# EAGLE design fmcboard_v1.2 (EAGLE 9.6.2)

## Sheet 1 of 4: Power, IO, Arduino
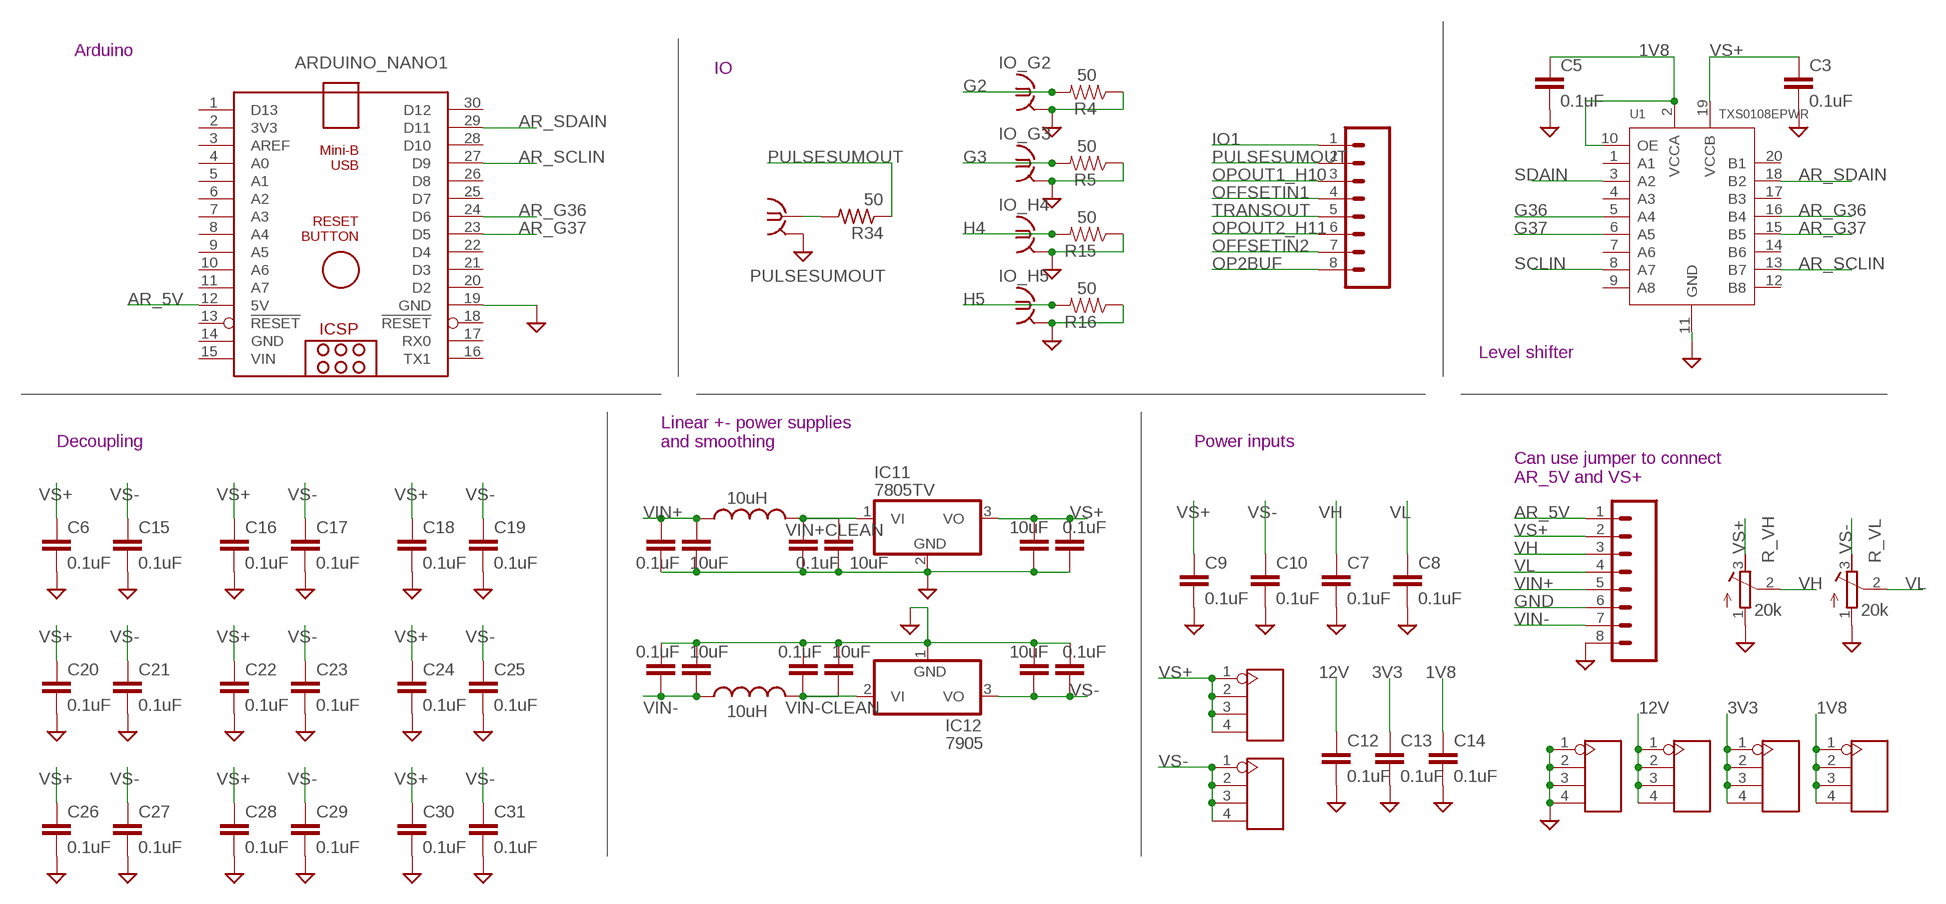
[diagram p0: schematic, sheet 1]

### Parts
ARDUINO_NANO1  1  ARDUINO_NANO  [ARDUINO_NANO]
C1  10uF  CAPPTH1  [CAP-PTH-5MM]
C2  10uF  CAPPTH1  [CAP-PTH-5MM]
C3  0.1uF  CAP0805  [0805]
C5  0.1uF  CAP0805  [0805]
C6  0.1uF  CAP0805  [0805]
C7  0.1uF  CAP0805  [0805]
C8  0.1uF  CAP0805  [0805]
C9  0.1uF  CAP0805  [0805]
C10  0.1uF  CAP0805  [0805]
C12  0.1uF  CAP0805  [0805]
C13  0.1uF  CAP0805  [0805]
C14  0.1uF  CAP0805  [0805]
C15  0.1uF  CAP0805  [0805]
C16  0.1uF  CAP0805  [0805]
C17  0.1uF  CAP0805  [0805]
C18  0.1uF  CAP0805  [0805]
C19  0.1uF  CAP0805  [0805]
C20  0.1uF  CAP0805  [0805]
C21  0.1uF  CAP0805  [0805]
C22  0.1uF  CAP0805  [0805]
C23  0.1uF  CAP0805  [0805]
C24  0.1uF  CAP0805  [0805]
C25  0.1uF  CAP0805  [0805]
C26  0.1uF  CAP0805  [0805]
C27  0.1uF  CAP0805  [0805]
C28  0.1uF  CAP0805  [0805]
C29  0.1uF  CAP0805  [0805]
C30  0.1uF  CAP0805  [0805]
C31  0.1uF  CAP0805  [0805]
C38  10uF  CAPPTH1  [CAP-PTH-5MM]
C39  10uF  CAPPTH1  [CAP-PTH-5MM]
C40  10uF  CAPPTH1  [CAP-PTH-5MM]
C41  10uF  CAPPTH1  [CAP-PTH-5MM]
C42  0.1uF  CAP0805  [0805]
C43  0.1uF  CAP0805  [0805]
C44  0.1uF  CAP0805  [0805]
C45  0.1uF  CAP0805  [0805]
C46  0.1uF  CAP0805  [0805]
C47  0.1uF  CAP0805  [0805]
IC11  7805TV  [TO220V]
IC12  7905  7905T  [TO220H]
IO_G2  BU-SMB-V  [BU-SMB-V]
IO_G3  BU-SMB-V  [BU-SMB-V]
IO_H4  BU-SMB-V  [BU-SMB-V]
IO_H5  BU-SMB-V  [BU-SMB-V]
J1  8pin  CONN_08"  [1X08]
J3  4p-2.54  DIP-BLACK-FEMALE-HEADER-VERT(4P-2.54)  [H4-2.54]
J4  4p-2.54  DIP-BLACK-FEMALE-HEADER-VERT(4P-2.54)  [H4-2.54]
J5  8pin  CONN_08"  [1X08]
J6  4p-2.54  DIP-BLACK-FEMALE-HEADER-VERT(4P-2.54)  [H4-2.54]
J7  4p-2.54  DIP-BLACK-FEMALE-HEADER-VERT(4P-2.54)  [H4-2.54]
J8  4p-2.54  DIP-BLACK-FEMALE-HEADER-VERT(4P-2.54)  [H4-2.54]
J12  4p-2.54  DIP-BLACK-FEMALE-HEADER-VERT(4P-2.54)  [H4-2.54]
L1  10uH  L-US6000-XXX-RC  [6000-XXXX-RC]
L2  10uH  L-US6000-XXX-RC  [6000-XXXX-RC]
PULSESUMOUT  BU-SMB-V  [BU-SMB-V]
R4  50  RESISTORAXIAL-0.3  [AXIAL-0.3]
R5  50  RESISTORAXIAL-0.3  [AXIAL-0.3]
R15  50  RESISTORAXIAL-0.3  [AXIAL-0.3]
R16  50  RESISTORAXIAL-0.3  [AXIAL-0.3]
R34  50  R-US_R0805  [R0805]
R_VH  20k  R-TRIMM3296W  [RTRIM3296W]
R_VL  20k  R-TRIMM3296W  [RTRIM3296W]
U1  TXS0108EPWR  LOGIC-TXS0108EPWR(TSSOP20)  [TSSOP20-0.65-6.5X4.4MM]

### Nets
1V8 [power]: C5.1 C14.1 J12.1 J12.2 J12.3 J12.4 U1.2(VCCA) U1.10(OE) ; also sheet 4
3V3 [power]: C13.1 J3.1 J3.2 J3.3 J3.4 ; also sheet 4
12V [power]: C12.1 J8.1 J8.2 J8.3 J8.4 ; also sheet 4
AR_5V [power]: ARDUINO_NANO1.12(5V) J1.1
AR_G36: ARDUINO_NANO1.24(D6) U1.16(B4)
AR_G37: ARDUINO_NANO1.23(D5) U1.15(B5)
AR_SCLIN: ARDUINO_NANO1.27(D9) U1.13(B7)
AR_SDAIN: ARDUINO_NANO1.29(D11) U1.18(B2)
G2: IO_G2.1 R4.P$2 ; also sheet 4
G3: IO_G3.1 R5.P$2 ; also sheet 4
G36: U1.5(A4) ; also sheet 4
G37: U1.6(A5) ; also sheet 4
GND [gnd]: ARDUINO_NANO1.19(GND) C1.2 C2.1 C3.2 C5.2 C6.2 C7.2 C8.2 C9.2 C10.2 C12.2 C13.2 C14.2 C15.2 C16.2 C17.2 C18.2 C19.2 C20.2 C21.2 C22.2 C23.2 C24.2 C25.2 C26.2 C27.2 C28.2 C29.2 C30.2 C31.2 C38.2 C39.2 C40.2 C41.2 C42.2 C43.2 C44.1 C45.1 C46.1 C47.2 IC11.2(GND) IC12.1(GND) IO_G2.2 IO_G2.3 IO_G2.4 IO_G2.5 IO_G3.2 IO_G3.3 IO_G3.4 IO_G3.5 IO_H4.2 IO_H4.3 IO_H4.4 IO_H4.5 IO_H5.2 IO_H5.3 IO_H5.4 IO_H5.5 J1.6 J1.8 J4.1 J4.2 J4.3 J4.4 PULSESUMOUT.2 PULSESUMOUT.3 PULSESUMOUT.4 PULSESUMOUT.5 R4.P$1 R5.P$1 R15.P$1 R16.P$1 R_VH.1(A) R_VL.1(A) U1.11(GND) ; also sheet 2,3,4
H4: IO_H4.1 R15.P$2 ; also sheet 4
H5: IO_H5.1 R16.P$2 ; also sheet 4
IO1: J5.1 ; also sheet 3
N$18: PULSESUMOUT.1 R34.2
OFFSETIN1: J5.4 ; also sheet 3
OFFSETIN2: J5.7 ; also sheet 3
OP2BUF: J5.8 ; also sheet 3
OPOUT1_H10: J5.3 ; also sheet 3,4
OPOUT2_H11: J5.6 ; also sheet 3,4
PULSESUMOUT: J5.2 R34.1 ; also sheet 3
SCLIN: U1.8(A7) ; also sheet 4
SDAIN: U1.3(A2) ; also sheet 4
TRANSOUT: J5.5 ; also sheet 3
VH: C7.1 J1.3 R_VH.2(S) ; also sheet 3
VIN+ [power]: C39.1 C42.1 J1.5 L1.1
VIN+CLEAN [power]: C38.1 C43.1 IC11.1(VI) L1.2
VIN- [power]: C40.1 C44.2 J1.7 L2.1
VIN-CLEAN [power]: C41.1 C45.2 IC12.2(VI) L2.2
VL: C8.1 J1.4 R_VL.2(S) ; also sheet 3
VS+ [power]: C1.1 C3.1 C6.1 C9.1 C16.1 C18.1 C20.1 C22.1 C24.1 C26.1 C28.1 C30.1 C47.1 IC11.3(VO) J1.2 J6.1 J6.2 J6.3 J6.4 R_VH.3(E) U1.19(VCCB) ; also sheet 2,3
VS- [power]: C2.2 C10.1 C15.1 C17.1 C19.1 C21.1 C23.1 C25.1 C27.1 C29.1 C31.1 C46.2 IC12.3(VO) J7.1 J7.2 J7.3 J7.4 R_VL.3(E) ; also sheet 2,3
Unconnected: ARDUINO_NANO1.1(D13) ARDUINO_NANO1.2(3V3) ARDUINO_NANO1.3(AREF) ARDUINO_NANO1.4(A0) ARDUINO_NANO1.5(A1) ARDUINO_NANO1.6(A2) ARDUINO_NANO1.7(A3) ARDUINO_NANO1.8(A4) ARDUINO_NANO1.9(A5) ARDUINO_NANO1.10(A6) ARDUINO_NANO1.11(A7) ARDUINO_NANO1.13(!RESET) ARDUINO_NANO1.16(TX1) ARDUINO_NANO1.17(RX0) ARDUINO_NANO1.18(!RESET) ARDUINO_NANO1.20(D2) ARDUINO_NANO1.21(D3) ARDUINO_NANO1.22(D4) ARDUINO_NANO1.25(D7) ARDUINO_NANO1.26(D8) ARDUINO_NANO1.28(D10) ARDUINO_NANO1.30(D12) U1.1(A1) U1.4(A3) U1.7(A6) U1.9(A8) U1.12(B8) U1.14(B6) U1.17(B3) U1.20(B1)

### Notes on the sheet
- Arduino
- IO
- Level shifter
- Decoupling
- Linear +- power supplies
  and smoothing
- Power inputs
- Can use jumper to connect 
  AR_5V and VS+

## Sheet 2 of 4: Pulse generator
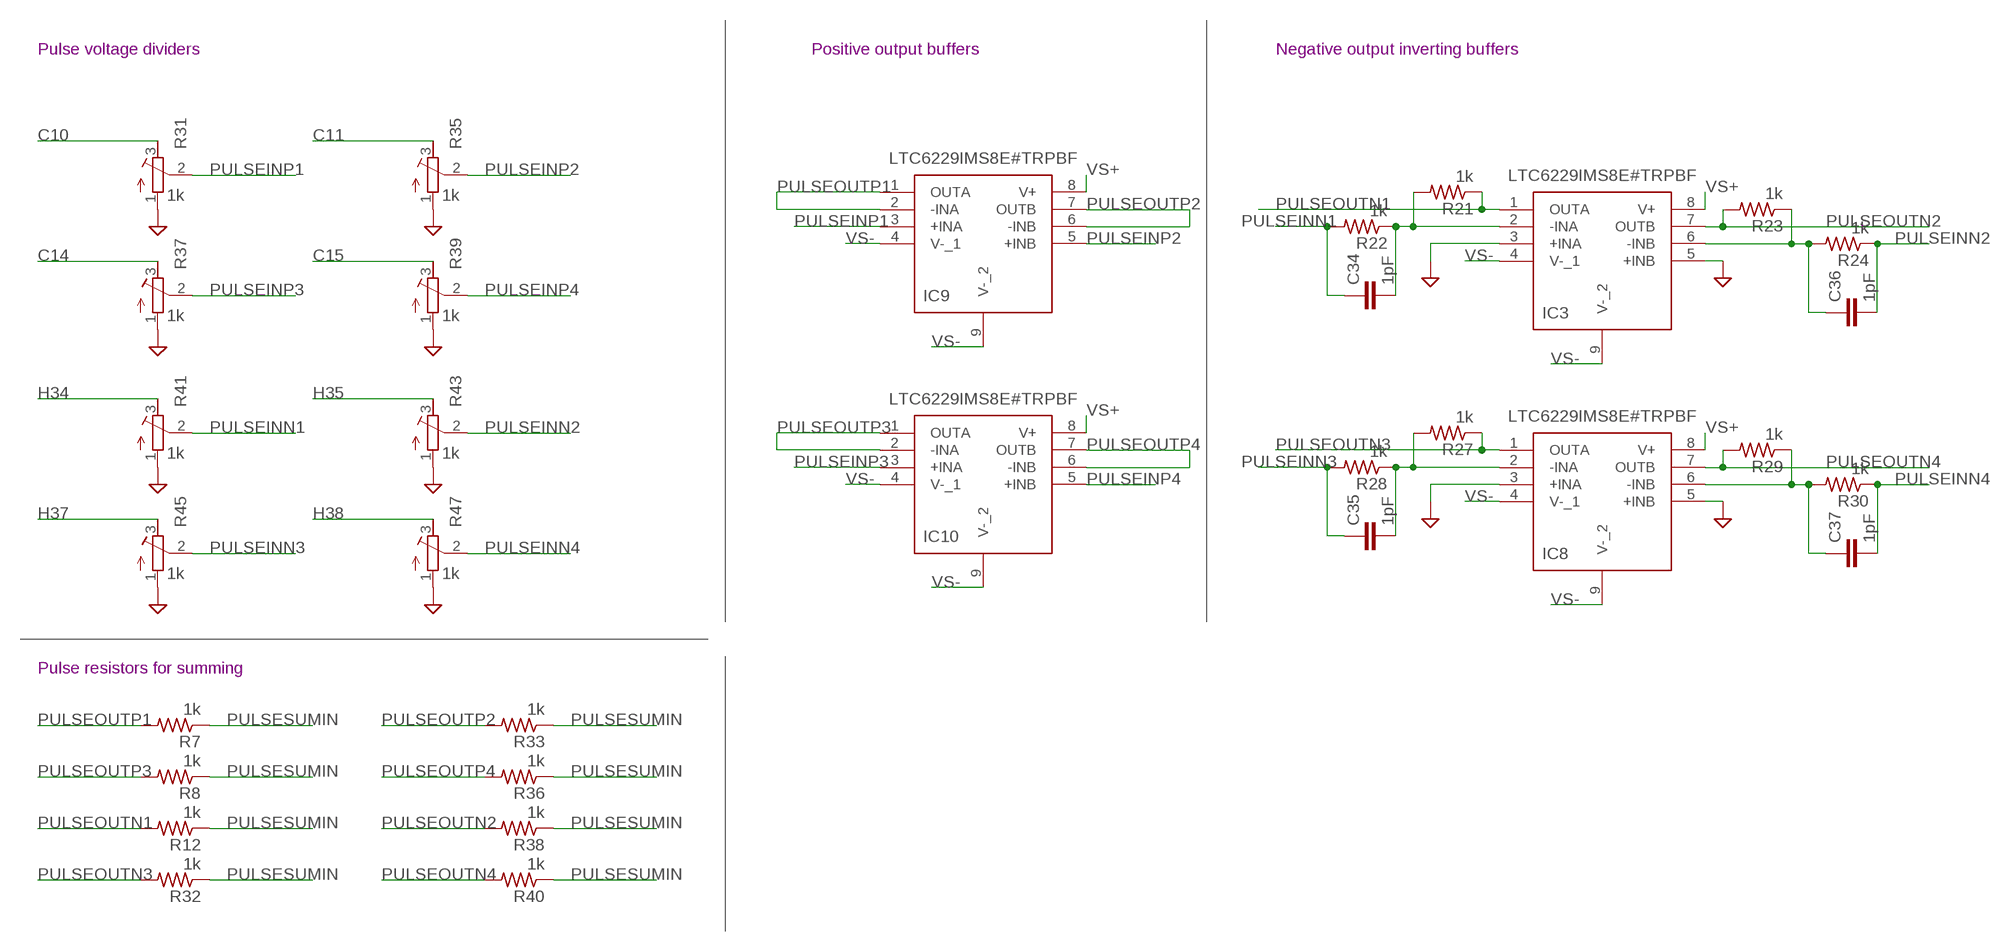
[diagram p1: schematic, sheet 2]

### Parts
C34  1pF  CAP0805  [0805]
C35  1pF  CAP0805  [0805]
C36  1pF  CAP0805  [0805]
C37  1pF  CAP0805  [0805]
IC3  LTC6229IMS8E#TRPBF  [SOP65P490X110-9N]
IC8  LTC6229IMS8E#TRPBF  [SOP65P490X110-9N]
IC9  LTC6229IMS8E#TRPBF  [SOP65P490X110-9N]
IC10  LTC6229IMS8E#TRPBF  [SOP65P490X110-9N]
R7  1k  R-US_R0805  [R0805]
R8  1k  R-US_R0805  [R0805]
R12  1k  R-US_R0805  [R0805]
R21  1k  R-US_R0805  [R0805]
R22  1k  R-US_R0805  [R0805]
R23  1k  R-US_R0805  [R0805]
R24  1k  R-US_R0805  [R0805]
R27  1k  R-US_R0805  [R0805]
R28  1k  R-US_R0805  [R0805]
R29  1k  R-US_R0805  [R0805]
R30  1k  R-US_R0805  [R0805]
R31  1k  R-TRIMM3296W  [RTRIM3296W]
R32  1k  R-US_R0805  [R0805]
R33  1k  R-US_R0805  [R0805]
R35  1k  R-TRIMM3296W  [RTRIM3296W]
R36  1k  R-US_R0805  [R0805]
R37  1k  R-TRIMM3296W  [RTRIM3296W]
R38  1k  R-US_R0805  [R0805]
R39  1k  R-TRIMM3296W  [RTRIM3296W]
R40  1k  R-US_R0805  [R0805]
R41  1k  R-TRIMM3296W  [RTRIM3296W]
R43  1k  R-TRIMM3296W  [RTRIM3296W]
R45  1k  R-TRIMM3296W  [RTRIM3296W]
R47  1k  R-TRIMM3296W  [RTRIM3296W]

### Nets
C10: R31.3(E) ; also sheet 4
C11: R35.3(E) ; also sheet 4
C14: R37.3(E) ; also sheet 4
C15: R39.3(E) ; also sheet 4
GND [gnd]: IC3.3(+INA) IC3.5(+INB) IC8.3(+INA) IC8.5(+INB) R31.1(A) R35.1(A) R37.1(A) R39.1(A) R41.1(A) R43.1(A) R45.1(A) R47.1(A) ; also sheet 1,3,4
H34: R41.3(E) ; also sheet 4
H35: R43.3(E) ; also sheet 4
H37: R45.3(E) ; also sheet 4
H38: R47.3(E) ; also sheet 4
N$4: C36.1 IC3.6(-INB) R23.1 R24.2
N$12: C35.2 IC8.2(-INA) R27.2 R28.1
N$13: C34.2 IC3.2(-INA) R21.2 R22.1
N$14: C37.1 IC8.6(-INB) R29.1 R30.2
PULSEINN1: C34.1 R22.2 R41.2(S)
PULSEINN2: C36.2 R24.1 R43.2(S)
PULSEINN3: C35.1 R28.2 R45.2(S)
PULSEINN4: C37.2 R30.1 R47.2(S)
PULSEINP1: IC9.3(+INA) R31.2(S)
PULSEINP2: IC9.5(+INB) R35.2(S)
PULSEINP3: IC10.3(+INA) R37.2(S)
PULSEINP4: IC10.5(+INB) R39.2(S)
PULSEOUTN1: IC3.1(OUTA) R12.2 R21.1
PULSEOUTN2: IC3.7(OUTB) R23.2 R38.2
PULSEOUTN3: IC8.1(OUTA) R27.1 R32.2
PULSEOUTN4: IC8.7(OUTB) R29.2 R40.2
PULSEOUTP1: IC9.1(OUTA) IC9.2(-INA) R7.2
PULSEOUTP2: IC9.6(-INB) IC9.7(OUTB) R33.2
PULSEOUTP3: IC10.1(OUTA) IC10.2(-INA) R8.2
PULSEOUTP4: IC10.6(-INB) IC10.7(OUTB) R36.2
PULSESUMIN: R7.1 R8.1 R12.1 R32.1 R33.1 R36.1 R38.1 R40.1 ; also sheet 3
VS+ [power]: IC3.8(V+) IC8.8(V+) IC9.8(V+) IC10.8(V+) ; also sheet 1,3
VS- [power]: IC3.4(V-_1) IC3.9(V-_2) IC8.4(V-_1) IC8.9(V-_2) IC9.4(V-_1) IC9.9(V-_2) IC10.4(V-_1) IC10.9(V-_2) ; also sheet 1,3

### Notes on the sheet
- Pulse voltage dividers | Positive output buffers | Negative output inverting buffers
- Pulse resistors for summing

## Sheet 3 of 4: Input amplifiers
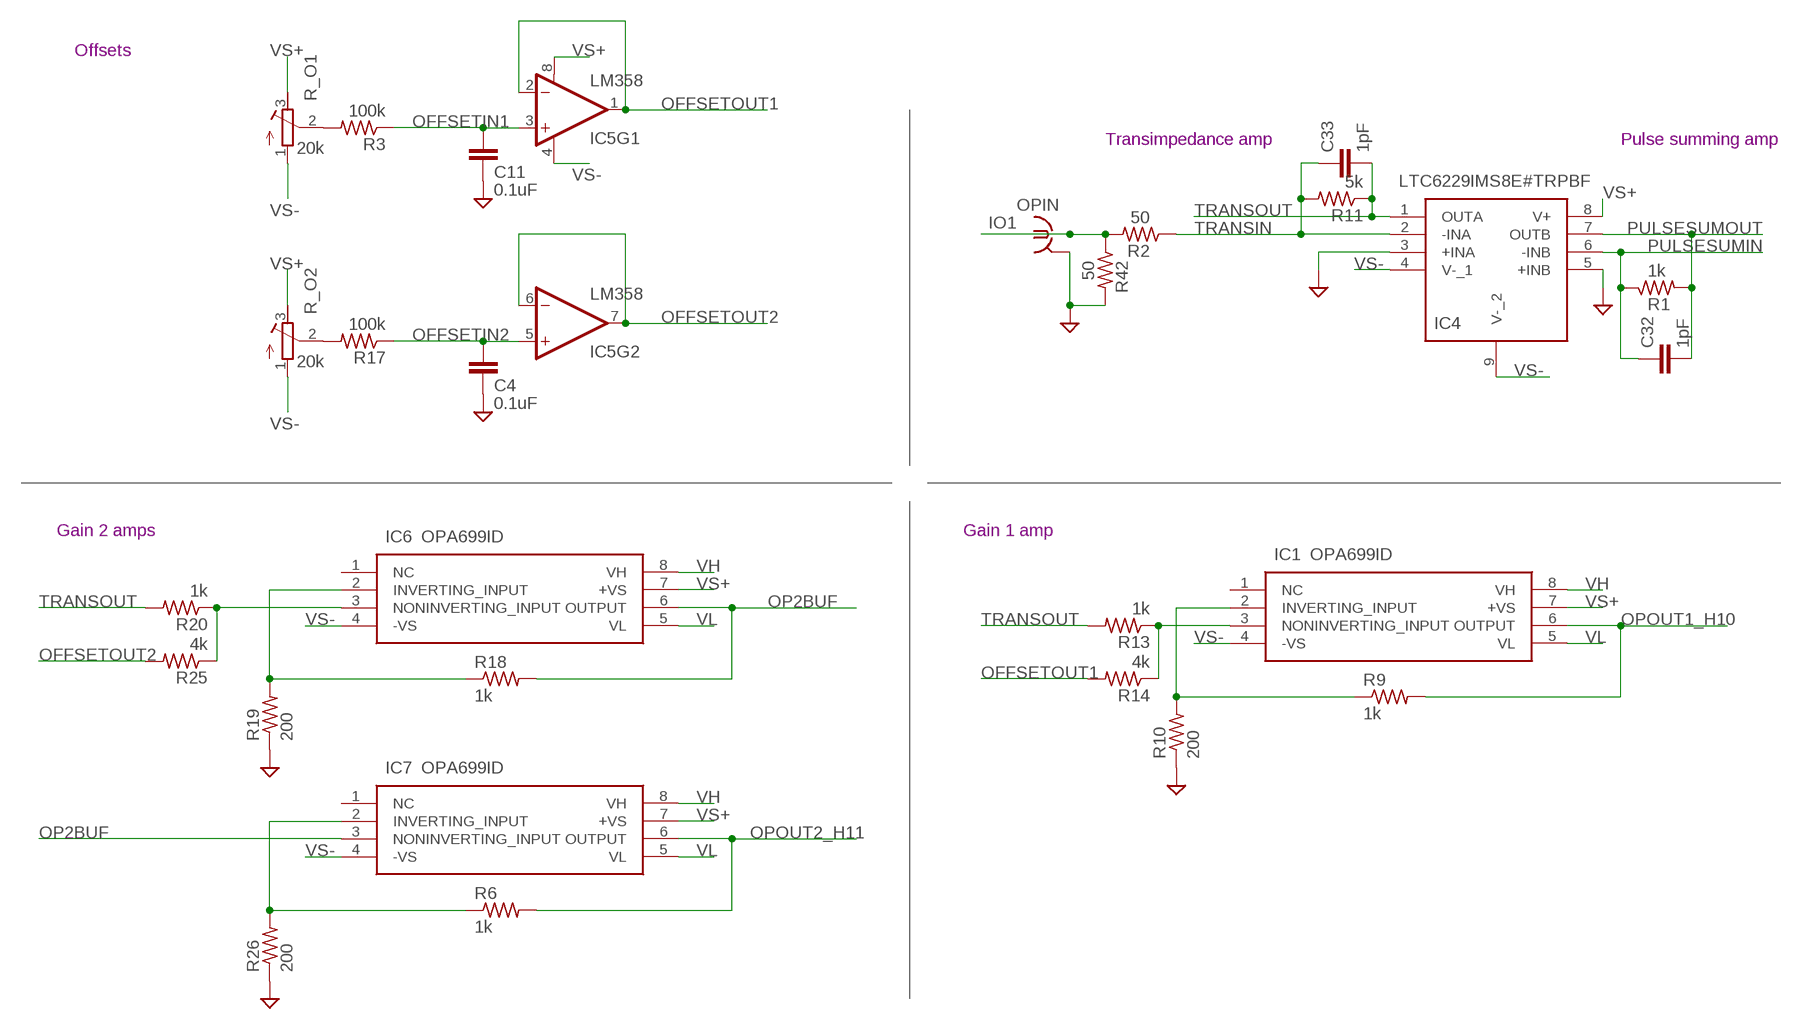
[diagram p2: schematic, sheet 3]

### Parts
C4  0.1uF  CAP0805  [0805]
C11  0.1uF  CAP0805  [0805]
C32  1pF  CAP0805  [0805]
C33  1pF  CAP0805  [0805]
IC1  OPA699ID  [SOIC127P600X175-8N]
IC4  LTC6229IMS8E#TRPBF  [SOP65P490X110-9N]
IC5  LM358  [DIP08]
IC6  OPA699ID  [SOIC127P600X175-8N]
IC7  OPA699ID  [SOIC127P600X175-8N]
OPIN  BU-SMB-V  [BU-SMB-V]
R1  1k  R-US_R0805  [R0805]
R2  50  R-US_R0805  [R0805]
R3  100k  R-US_R0805  [R0805]
R6  1k  R-US_R0805  [R0805]
R9  1k  R-US_R0805  [R0805]
R10  200  R-US_R0805  [R0805]
R11  5k  R-US_R0805  [R0805]
R13  1k  R-US_R0805  [R0805]
R14  4k  R-US_R0805  [R0805]
R17  100k  R-US_R0805  [R0805]
R18  1k  R-US_R0805  [R0805]
R19  200  R-US_R0805  [R0805]
R20  1k  R-US_R0805  [R0805]
R25  4k  R-US_R0805  [R0805]
R26  200  R-US_R0805  [R0805]
R42  50  R-US_R0805  [R0805]
R_O1  20k  R-TRIMM3296W  [RTRIM3296W]
R_O2  20k  R-TRIMM3296W  [RTRIM3296W]

### Nets
GND [gnd]: C4.2 C11.2 IC4.3(+INA) IC4.5(+INB) OPIN.2 OPIN.3 OPIN.4 OPIN.5 R10.1 R19.1 R26.1 R42.2 ; also sheet 1,2,4
IO1: OPIN.1 R2.2 R42.1 ; also sheet 1
N$1: IC1.3(NONINVERTING_INPUT) R13.1 R14.1
N$2: R17.2 R_O2.2(S)
N$3: IC1.2(INVERTING_INPUT) R9.1 R10.2
N$8: R3.2 R_O1.2(S)
N$9: IC6.2(INVERTING_INPUT) R18.1 R19.2
N$10: IC6.3(NONINVERTING_INPUT) R20.1 R25.1
N$11: IC7.2(INVERTING_INPUT) R6.1 R26.2
OFFSETIN1: C11.1 IC5.3(+IN) R3.1 ; also sheet 1
OFFSETIN2: C4.1 IC5.5(+IN) R17.1 ; also sheet 1
OFFSETOUT1: IC5.1(OUT) IC5.2(-IN) R14.2
OFFSETOUT2: IC5.6(-IN) IC5.7(OUT) R25.2
OP2BUF: IC6.6(OUTPUT) IC7.3(NONINVERTING_INPUT) R18.2 ; also sheet 1
OPOUT1_H10: IC1.6(OUTPUT) R9.2 ; also sheet 1,4
OPOUT2_H11: IC7.6(OUTPUT) R6.2 ; also sheet 1,4
PULSESUMIN: C32.1 IC4.6(-INB) R1.1 ; also sheet 2
PULSESUMOUT: C32.2 IC4.7(OUTB) R1.2 ; also sheet 1
TRANSIN: C33.1 IC4.2(-INA) R2.1 R11.2
TRANSOUT: C33.2 IC4.1(OUTA) R11.1 R13.2 R20.2 ; also sheet 1
VH: IC1.8(VH) IC6.8(VH) IC7.8(VH) ; also sheet 1
VL: IC1.5(VL) IC6.5(VL) IC7.5(VL) ; also sheet 1
VS+ [power]: IC1.7(+VS) IC4.8(V+) IC5.8(V+) IC6.7(+VS) IC7.7(+VS) R_O1.3(E) R_O2.3(E) ; also sheet 1,2
VS- [power]: IC1.4(-VS) IC4.4(V-_1) IC4.9(V-_2) IC5.4(V-) IC6.4(-VS) IC7.4(-VS) R_O1.1(A) R_O2.1(A) ; also sheet 1,2
Unconnected: IC1.1(NC) IC6.1(NC) IC7.1(NC)

### Notes on the sheet
- Offsets
- Transimpedance amp | Pulse summing amp
- Gain 2 amps | Gain 1 amp

## Sheet 4 of 4: FMC connections
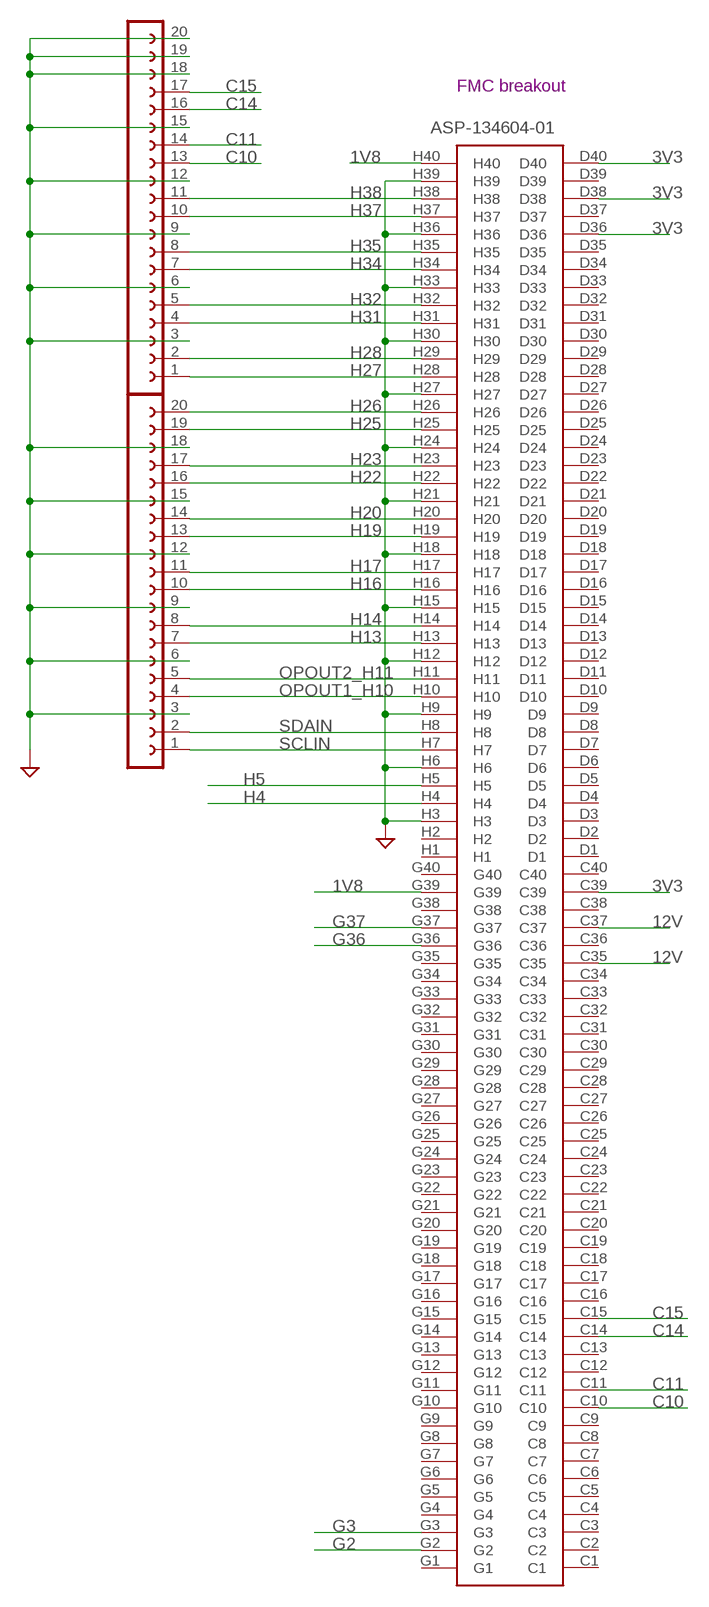
[diagram p3: schematic, sheet 4]

### Parts
J2  ASP-134604-01  [ASP13460401]
SV1  20  FE20-1  [FE20]
SV2  20  FE20-1  [FE20]

### Nets
1V8 [power]: J2.G39 J2.H40 ; also sheet 1
3V3 [power]: J2.C39 J2.D36 J2.D38 J2.D40 ; also sheet 1
12V [power]: J2.C35 J2.C37 ; also sheet 1
C10: J2.C10 SV2.13 ; also sheet 2
C11: J2.C11 SV2.14 ; also sheet 2
C14: J2.C14 SV2.16 ; also sheet 2
C15: J2.C15 SV2.17 ; also sheet 2
G2: J2.G2 ; also sheet 1
G3: J2.G3 ; also sheet 1
G36: J2.G36 ; also sheet 1
G37: J2.G37 ; also sheet 1
GND [gnd]: J2.H3 J2.H6 J2.H9 J2.H12 J2.H15 J2.H18 J2.H21 J2.H24 J2.H27 J2.H30 J2.H33 J2.H36 J2.H39 SV1.3 SV1.6 SV1.9 SV1.12 SV1.15 SV1.18 SV2.3 SV2.6 SV2.9 SV2.12 SV2.15 SV2.18 SV2.19 SV2.20 ; also sheet 1,2,3
H4: J2.H4 ; also sheet 1
H5: J2.H5 ; also sheet 1
H13: J2.H13 SV1.7
H14: J2.H14 SV1.8
H16: J2.H16 SV1.10
H17: J2.H17 SV1.11
H19: J2.H19 SV1.13
H20: J2.H20 SV1.14
H22: J2.H22 SV1.16
H23: J2.H23 SV1.17
H25: J2.H25 SV1.19
H26: J2.H26 SV1.20
H27: J2.H28 SV2.1
H28: J2.H29 SV2.2
H31: J2.H31 SV2.4
H32: J2.H32 SV2.5
H34: J2.H34 SV2.7 ; also sheet 2
H35: J2.H35 SV2.8 ; also sheet 2
H37: J2.H37 SV2.10 ; also sheet 2
H38: J2.H38 SV2.11 ; also sheet 2
OPOUT1_H10: J2.H10 SV1.4 ; also sheet 1,3
OPOUT2_H11: J2.H11 SV1.5 ; also sheet 1,3
SCLIN: J2.H7 SV1.1 ; also sheet 1
SDAIN: J2.H8 SV1.2 ; also sheet 1
Unconnected: J2.C1 J2.C2 J2.C3 J2.C4 J2.C5 J2.C6 J2.C7 J2.C8 J2.C9 J2.C12 J2.C13 J2.C16 J2.C17 J2.C18 J2.C19 J2.C20 J2.C21 J2.C22 J2.C23 J2.C24 J2.C25 J2.C26 J2.C27 J2.C28 J2.C29 J2.C30 J2.C31 J2.C32 J2.C33 J2.C34 J2.C36 J2.C38 J2.C40 J2.D1 J2.D2 J2.D3 J2.D4 J2.D5 J2.D6 J2.D7 J2.D8 J2.D9 J2.D10 J2.D11 J2.D12 J2.D13 J2.D14 J2.D15 J2.D16 J2.D17 J2.D18 J2.D19 J2.D20 J2.D21 J2.D22 J2.D23 J2.D24 J2.D25 J2.D26 J2.D27 J2.D28 J2.D29 J2.D30 J2.D31 J2.D32 J2.D33 J2.D34 J2.D35 J2.D37 J2.D39 J2.G1 J2.G4 J2.G5 J2.G6 J2.G7 J2.G8 J2.G9 J2.G10 J2.G11 J2.G12 J2.G13 J2.G14 J2.G15 J2.G16 J2.G17 J2.G18 J2.G19 J2.G20 J2.G21 J2.G22 J2.G23 J2.G24 J2.G25 J2.G26 J2.G27 J2.G28 J2.G29 J2.G30 J2.G31 J2.G32 J2.G33 J2.G34 J2.G35 J2.G38 J2.G40 J2.H1 J2.H2

### Notes on the sheet
- FMC breakout

## Power pins joined to a net without a drawn wire
GND: ARDUINO_NANO1.14(GND)
VIN: ARDUINO_NANO1.15(VIN)

## Library data of the parts
ARDUINO_NANO1 = ArduinoNanoV30:ARDUINO_NANO: Arduino Nano V3.0 Overview: The Arduino Nano is a small, complete, and breadboard-friendly board based on the ATmega328 (Arduino Nano 3.x) or ATmega168 (Arduino Nano 2.x). It has more or less the same functionality of the Arduino Duemilanove, but in a different package. It lacks only a DC power jack, and works with a Mini-B USB cable instead of a standard one. The Nano was designed and is being produced by Gravitech. Specifications: Microcontroller Atmel ATmega168 or ATmega328 Operating Voltage (logic level) 5 V Input Voltage (recommended) 7-12 V Input Voltage (limits) 6-20 V Digital I/O Pins 14 (of which 6 provide PWM output) Analog Input Pins 8 DC Current per I/O Pin 40 mA Flash Memory 16 KB (ATmega168) or 32 KB (ATmega328) of which 2 KB used by bootloader SRAM 1 KB (ATmega168) or 2 KB (ATmega328) EEPROM 512 bytes (ATmega168) or 1 KB (ATmega328) Clock Speed 16 MHz Dimensions 0.73" x 1.70" Length 45 mm Width 18 mm Weigth 5 g Power: The Arduino Nano can be powered via the Mini-B USB connection, 6-20V unregulated external power supply (pin 30), or 5V regulated external power supply (pin 27). The power source is automatically selected to the highest voltage source. Memory: The ATmega168 has 16 KB of flash memory for storing code (of which 2 KB is used for the bootloader); the ATmega328 has 32 KB, (also with 2 KB used for the bootloader). The ATmega168 has 1 KB of SRAM and 512 bytes of EEPROM (which can be read and written with the EEPROM library); the ATmega328 has 2 KB of SRAM and 1 KB of EEPROM. Input and Output: Each of the 14 digital pins on the Nano can be used as an input or output, using pinMode(), digitalWrite(), and digitalRead() functions. They operate at 5 volts. Each pin can provide or receive a maximum of 40 mA and has an internal pull-up resistor (disconnected by default) of 20-50 kOhms. In addition, some pins have specialized functions. Visit Arduino - ArduinoBoardNano <https://www.arduino.cc/en/Main/ArduinoBoardNano>
C1 C2 C38-C41 = SparkFun-Capacitors:CAP: Capacitor Standard 0603 ceramic capacitor, and 0.1" leaded capacitor.
C3-C37 C42-C47 = SparkFun-Passives:CAP: Capacitor Standard 0603 ceramic capacitor, and 0.1" leaded capacitor.
IC1 IC6 IC7 = OPA699ID:OPA699ID: Texas Instruments OPA699ID Op Amp, 880MHz, 9 V, 8-Pin SOIC Source: Datasheet <http://www.ti.com/lit/gpn/opa699>; DESCRIPTION: Texas Instruments OPA699ID Op Amp, 880MHz, 9 V, 8-Pin SOIC; HEIGHT: 1.75mm; MANUFACTURER_NAME: Texas Instruments; MANUFACTURER_PART_NUMBER: OPA699ID; MOUSER_PART_NUMBER: 595-OPA699ID; MOUSER_PRICE-STOCK: https://www.mouser.co.uk/ProductDetail/Texas-Instruments/OPA699ID?qs=wgAEGBTxy7n0Nk%252BpyQzyiA%3D%3D
IC3 IC4 IC8-IC10 = LTC6229IMS8E#TRPBF:LTC6229IMS8E#TRPBF: High Speed Operational Amplifiers Prec, Low Drift & Noise Hi Speed Amp Source: Datasheet <https://www.analog.com/media/en/technical-documentation/data-sheets/LTC6228-6229.pdf>; DESCRIPTION: High Speed Operational Amplifiers Prec, Low Drift & Noise Hi Speed Amp; HEIGHT: 1.1mm; MANUFACTURER_NAME: Analog Devices; MANUFACTURER_PART_NUMBER: LTC6229IMS8E#TRPBF; MOUSER_PART_NUMBER: 584-LTC6229IMS8E#TR; MOUSER_PRICE-STOCK: https://www.mouser.co.uk/ProductDetail/Analog-Devices/LTC6229IMS8ETRPBF?qs=BJlw7L4Cy7%252B3qToO7Cz9NQ%3D%3D
IC5 = SparkFun-AnalogIC:LM358: Jellybean op-amp; PROD_ID: IC-09172
IC11 = linear:78*: Positive VOLTAGE REGULATOR Source: http://cache.national.com/ds/LM/LM78L05.pdf http://www.fairchildsemi.com/ds/LM/LM7805.pdf
IC12 = linear:79*: Negative VOLTAGE REGULATOR
IO_G2 IO_G3 IO_H4 IO_H5 OPIN PULSESUMOUT = con-coax:BU-SMB-V: FEMALE SMB CONNECTOR Radiall distributor RS 112-2993; OC_FARNELL: unknown; OC_NEWARK: unknown
J1 J5 = SparkFun-Connectors:CONN_08: Multi connection point. Often used as Generic Header-pin footprint for 0.1 inch spaced/style header connections On any of the 0.1 inch spaced packages, you can populate with these: Break Away Headers - Straight <https://www.sparkfun.com/products/116> (PRT-00116) Break Away Male Headers - Right Angle <https://www.sparkfun.com/products/553> (PRT-00553) Female Headers <https://www.sparkfun.com/products/115> (PRT-00115) Break Away Headers - Machine Pin <https://www.sparkfun.com/products/117> (PRT-00117) Break Away Female Headers - Swiss Machine Pin <https://www.sparkfun.com/products/743> (PRT-00743) Arduino Stackable Header - 8 Pin <https://www.sparkfun.com/products/9279> (PRT-09279) For SCREWTERMINALS and SPRING TERMINALS visit here: Screw Terimnals on SparkFun.com <https://www.sparkfun.com/search/results?term=Screw+Terminals> (5mm/3.5mm/2.54mm spacing) This device is also useful as a general connection point to wire up your design to another part of your project. Our various solder wires solder well into these plated through hole pads. Hook-Up Wire - Assortment (Stranded, 22 AWG) <https://www.sparkfun.com/products/11375> (PRT-11375) Hook-Up Wire - Assortment (Solid Core, 22 AWG) <https://www.sparkfun.com/products/11367> (PRT-11367) View the entire wire category on our website here <https://www.sparkfun.com/categories/141> Special notes: Molex polarized connector foot print use with SKU : PRT-08231 with associated crimp pins and housings. 1MM SMD Version SKU: PRT-10208 NOTES ON THE VARIANTS LOCK and LOCK_LONGPADS... This footprint was designed to help hold the alignment of a through-hole component (i.e. 6-pin header) while soldering it into place. You may notice that each hole has been shifted either up or down by 0.005 of an inch from it's more standard position (which is a perfectly straight line). This slight alteration caused the pins (the squares in the middle) to touch the edges of the holes. Because they are alternating, it causes a "brace" to hold the component in place. 0.005 has proven to be the perfect amount of "off-center" position when using our standard breakaway headers. Although looks a little odd when you look at the bare footprint, once you have a header in there, the alteration is very hard to notice. Also,if you push a header all the way into place, it is covered up entirely on the bottom side.; PROD_ID: CONN-08438
J2 = ASP-134604-01:ASP-134604-01: SAMTEC - ASP-134604-01 - Board-To-Board Connector, Vita 57 XMC, 1.27 mm, 160 Contacts, Header, ASP Series, Surface Mount Source: Datasheet <https://componentsearchengine.com/Datasheets/2/ASP-134604-01.pdf>; DESCRIPTION: SAMTEC - ASP-134604-01 - Board-To-Board Connector, Vita 57 XMC, 1.27 mm, 160 Contacts, Header, ASP Series, Surface Mount; HEIGHT: 7.11mm; MANUFACTURER_NAME: SAMTEC; MANUFACTURER_PART_NUMBER: ASP-134604-01; MOUSER_PART_NUMBER: 200-ASP-134604-01; MOUSER_PRICE-STOCK: https://www.mouser.co.uk/ProductDetail/Samtec/ASP-134604-01?qs=Rp%2FUEJiACm00i8g2mQ6XNw%3D%3D
J3 J4 J6-J8 J12 = Seeed-Connector:DIP-BLACK-FEMALE-HEADER-VERT(4P-2.54): 320030017; MPN: F185-1104A1BSYA1
L1 L2 = rcl:L-US: INDUCTOR, American symbol; SPICEPREFIX: L
R1-R3 R6-R14 R17-R30 R32-R34 R36 R38 R40 R42 = rcl:R-US_: RESISTOR, American symbol; SPICEPREFIX: R
R4 R5 R15 R16 = SparkFun-Resistors:RESISTOR: Resistor Basic schematic elements and footprints for 0603, 1206, and PTH resistors.
R31 R35 R37 R39 R41 R43 R45 R47 R_O1 R_O2 R_VH R_VL = resistor:R-TRIMM: Trimm resistor
SV1 SV2 = con-lsta:FE20-1: FEMALE HEADER; OC_FARNELL: unknown; OC_NEWARK: unknown
U1 = Seeed-IC:LOGIC-TXS0108EPWR(TSSOP20): 310050026; MPN: TXS0108EPWR; VALUE: TXS0108EPWR-TSSOP20

## Net classes
0 default: width 0.305 mm
1 power: width 0.508 mm
2 gnd: width 0.305 mm

## Board
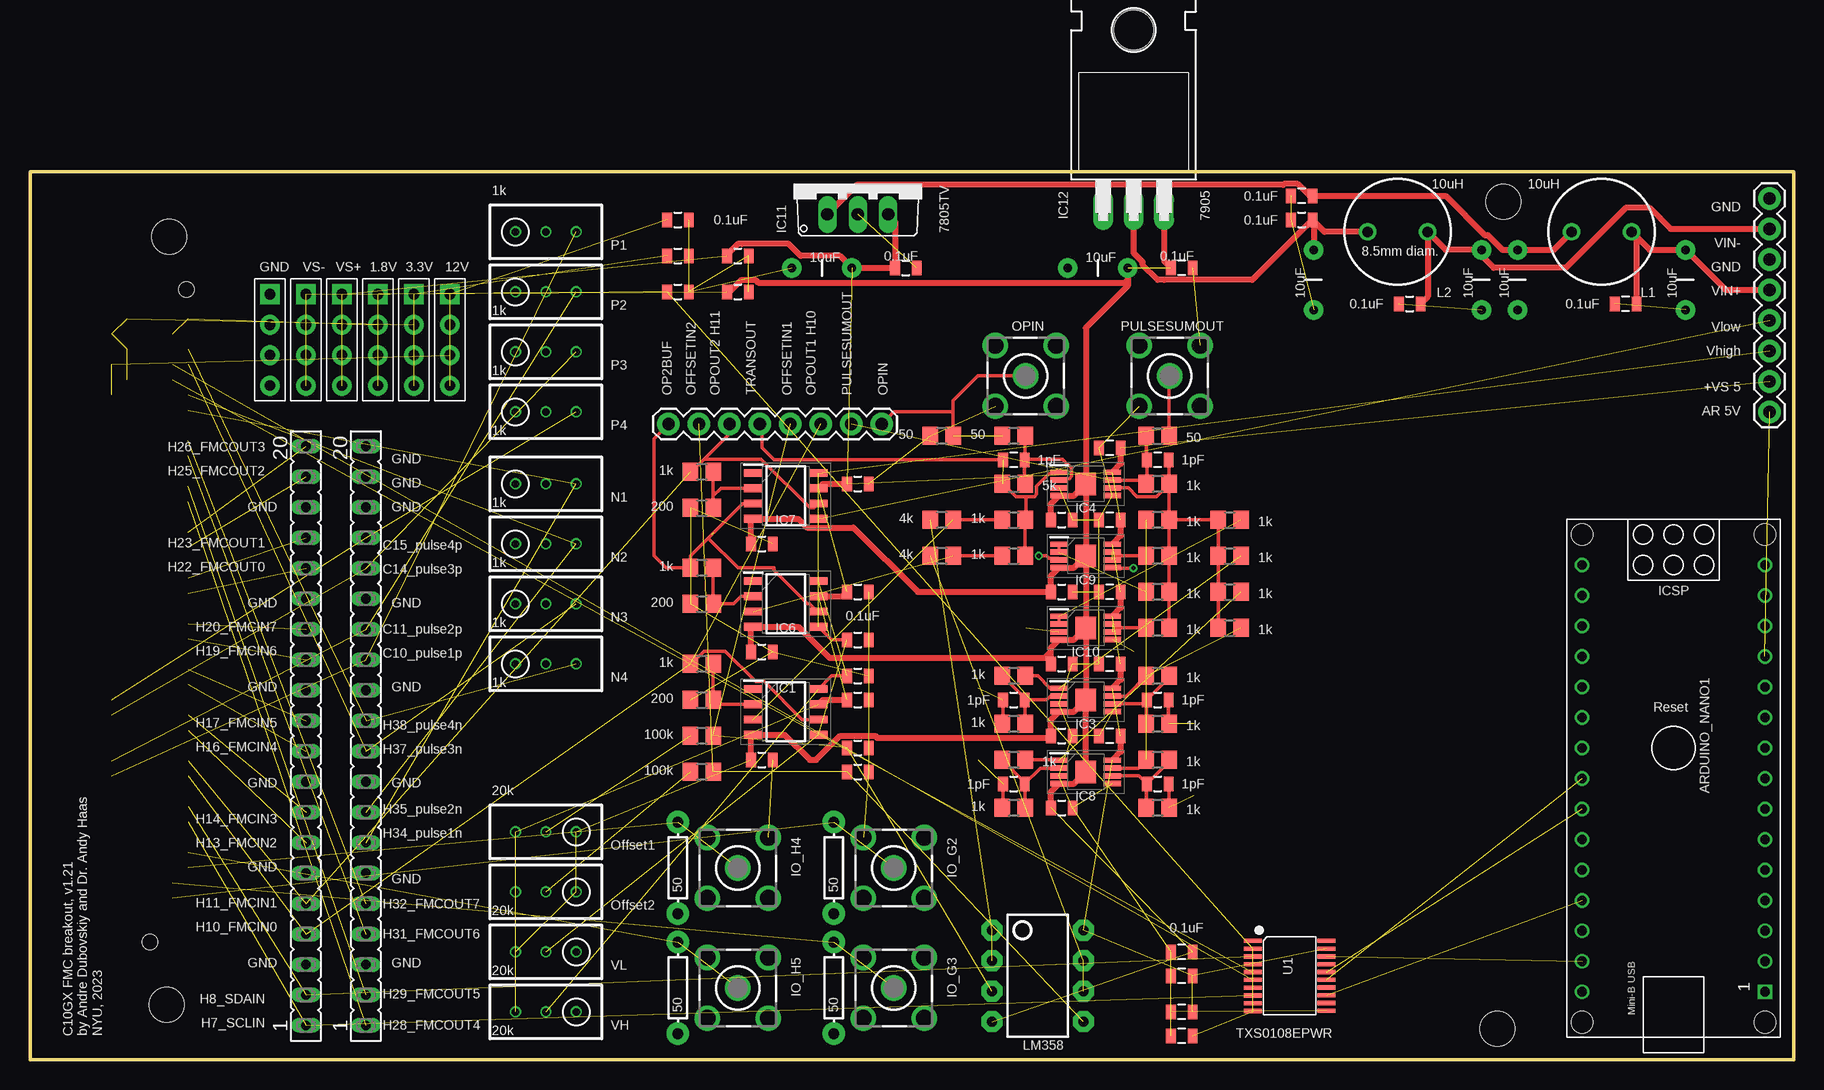
[diagram p4: board, top side]
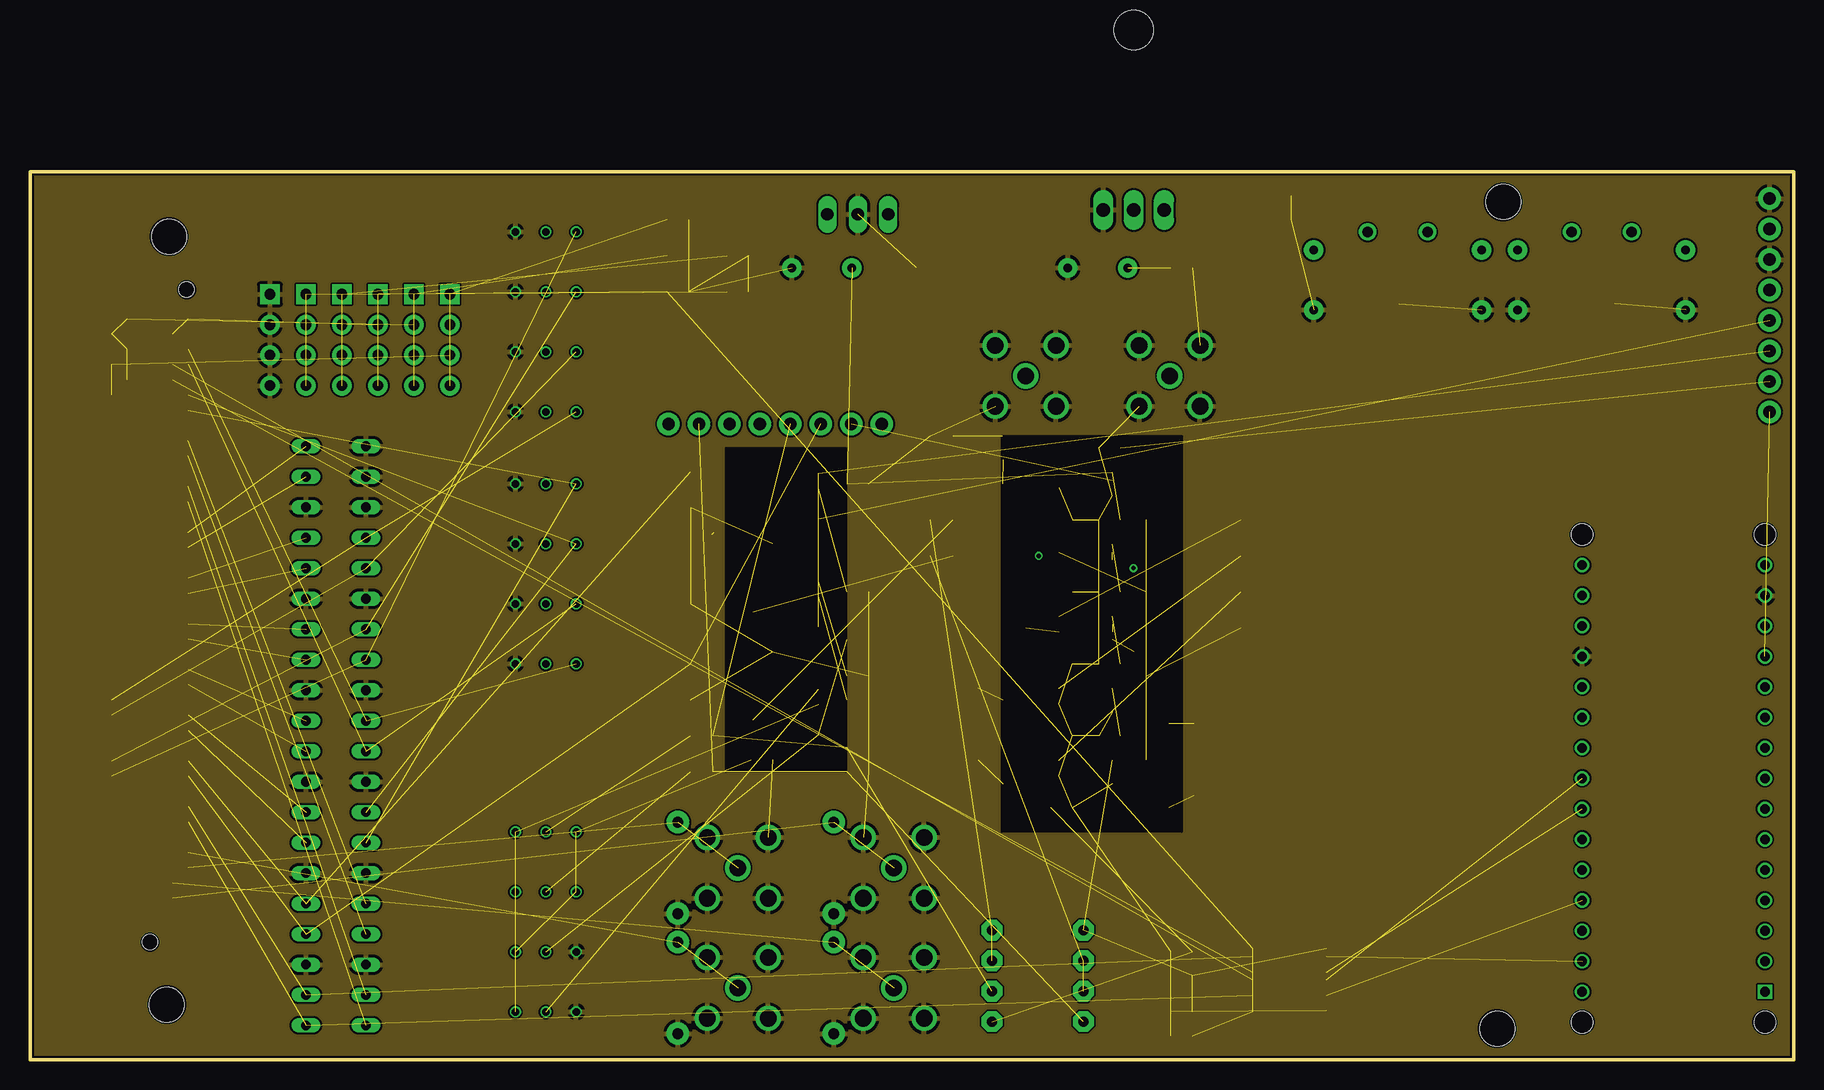
[diagram p5: board, inner layer topgnd]
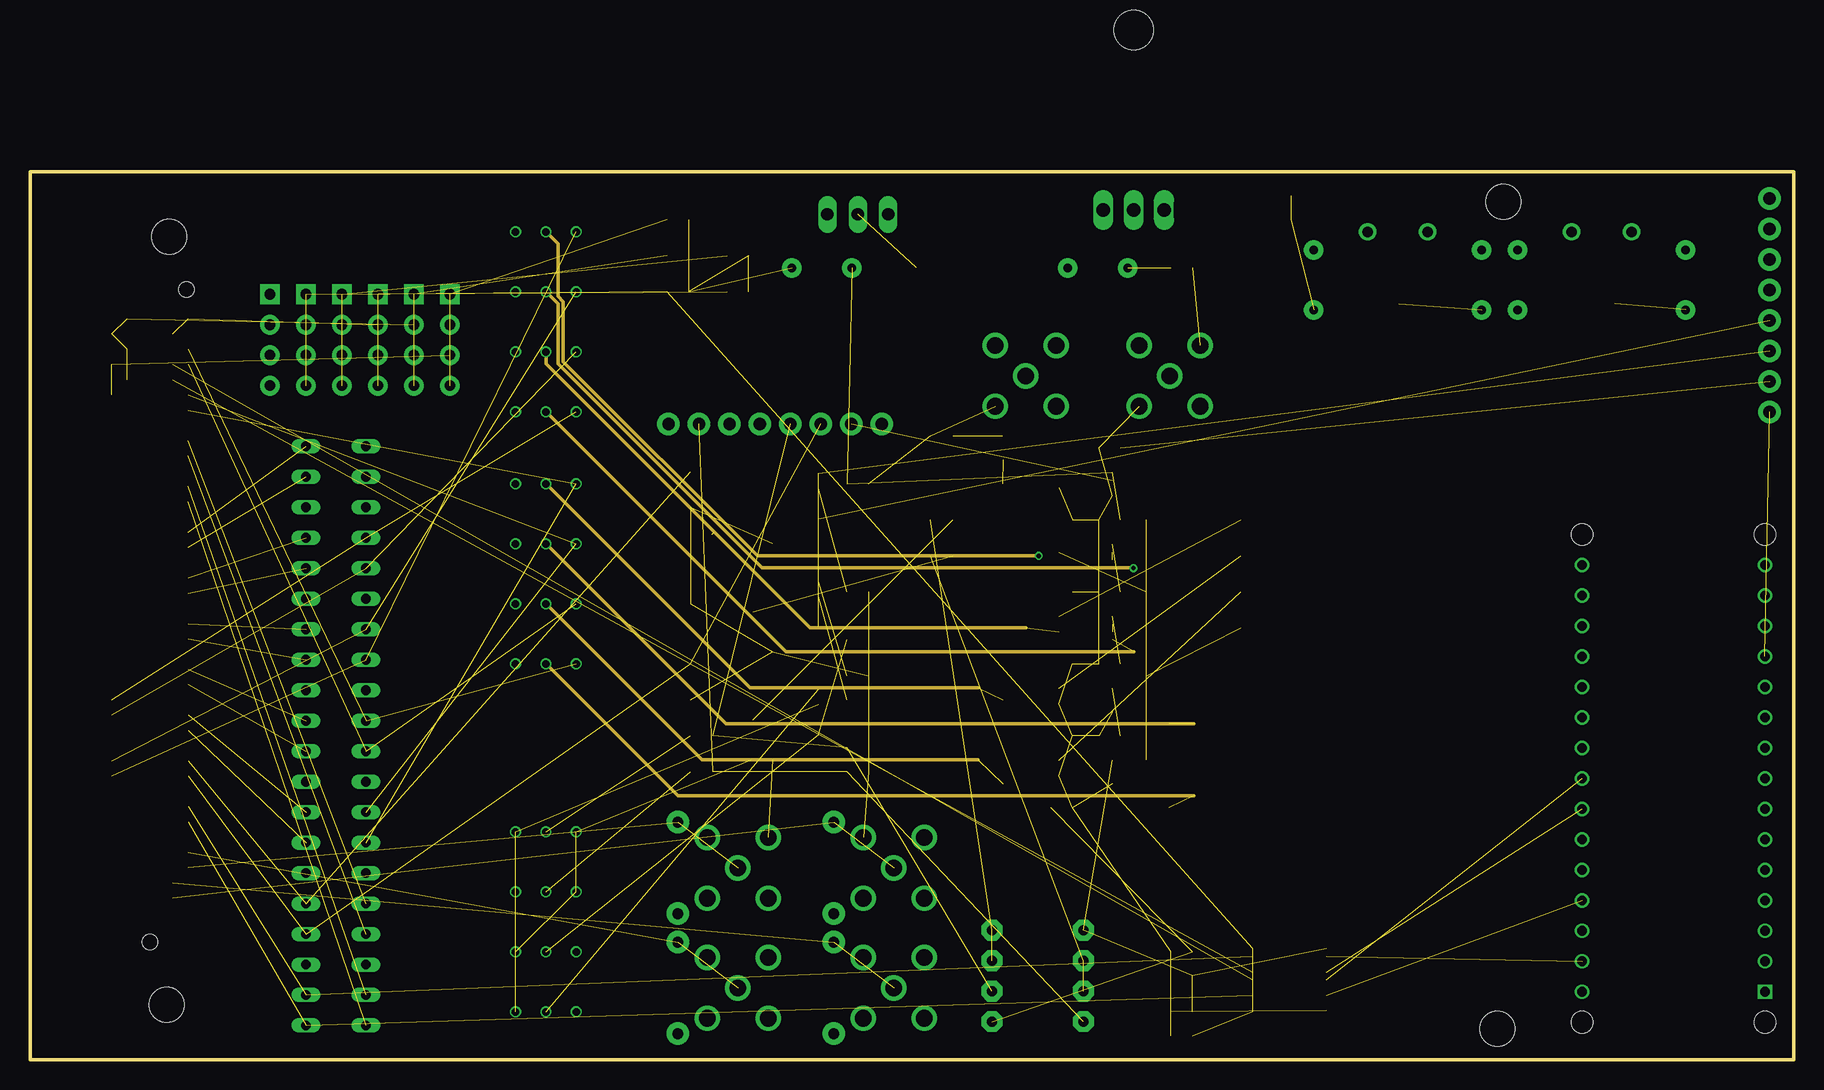
[diagram p6: board, inner layer route]
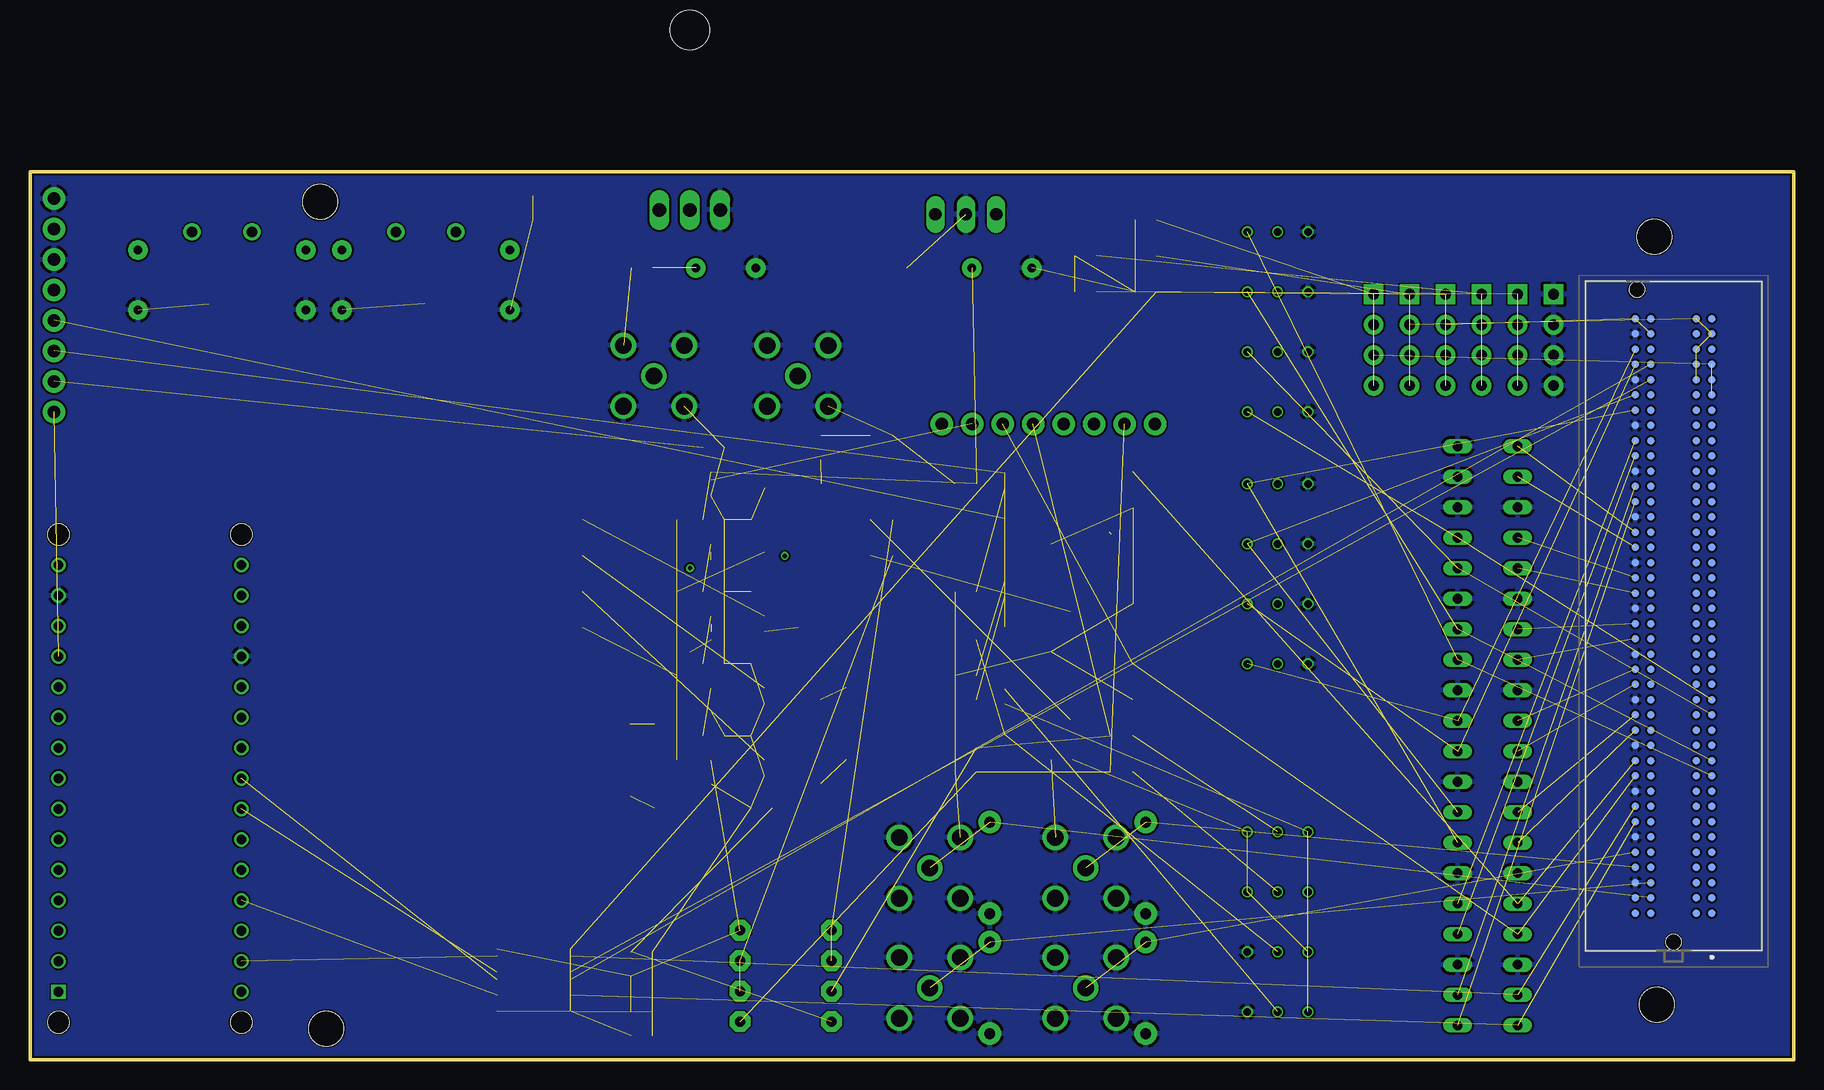
[diagram p7: board, bottom side, seen from below]

Size 147 x 74 mm. Coordinates in mm from the lower left corner, seen from the top.
Outline: 0,74 0,0 147,0 147,74 0,74
Copper layers (1*2*15*16): top 0.035mm / dielectric 0.2mm / topgnd 0.0175mm / dielectric 0.3mm / route 0.0175mm / dielectric 0.2mm / gnd 0.035mm
Design rules "Seeed_AllPCB_MacroFab_haas6mil": minimum track width 6mil, minimum drill 12mil, track to track 6mil, track to pad 6mil, pad to pad 6mil, via to via 6mil, smd to smd 0mil, copper to edge 6mil, drill to drill 6mil, minimum pad ring 6mil, minimum via ring 6mil, stop-mask expansion 6mil, vias tented up to drill 25mil, thermal gap 10mil
Holes 2.9 mm at 11.4,4.6 122.8,71.5 11.6,68.6 122.3,2.6

### Footprints (pad centres in the part's own frame; a part is rotated, then mirrored left to right if it is on the bottom)
ARDUINO_NANO = drill 0.8 square: 1 -20.32,-7.62 | drill 0.8: 2 -17.78,-7.62; 3 -15.24,-7.62; 4 -12.7,-7.62; 5 -10.16,-7.62; 6 -7.62,-7.62; 7 -5.08,-7.62; 8 -2.54,-7.62; 9 0,-7.62; 10 2.54,-7.62; 11 5.08,-7.62; 12 7.62,-7.62; 13 10.16,-7.62; 14 12.7,-7.62; 15 15.24,-7.62; 16 15.24,7.62; 17 12.7,7.62; 18 10.16,7.62; 19 7.62,7.62; 20 5.08,7.62; 21 2.54,7.62; 22 0,7.62; 23 -2.54,7.62; 24 -5.08,7.62; 25 -7.62,7.62; 26 -10.16,7.62; 27 -12.7,7.62; 28 -15.24,7.62; 29 -17.78,7.62; 30 -20.32,7.62 | hole 1.778: -22.86,-7.62; -22.86,7.62; 17.78,7.62; 17.78,-7.62
CAP-PTH-5MM = drill 0.7 pad 1.651: 1 -2.5,0; 2 2.5,0
0805 = smd 0.8 x 1.2: 1 -0.9,0; 2 0.9,0
SOIC127P600X175-8N = smd 1.528 x 0.65: 1 -2.711,1.905; 2 -2.711,0.635; 3 -2.711,-0.635; 4 -2.711,-1.905; 5 2.711,-1.905; 6 2.711,-0.635; 7 2.711,0.635; 8 2.711,1.905
SOP65P490X110-9N = smd 1.425 x 0.45: 1 -2.212,0.975; 2 -2.212,0.325; 3 -2.212,-0.325; 4 -2.212,-0.975; 5 2.212,-0.975; 6 2.212,-0.325; 7 2.212,0.325; 8 2.212,0.975 | smd 1.68 x 1.88: 9 0,0
DIP08 = drill 0.813 pad 1.727 octagon: 1 -3.81,-3.81; 2 -1.27,-3.81; 3 1.27,-3.81; 4 3.81,-3.81; 5 3.81,3.81; 6 1.27,3.81; 7 -1.27,3.81; 8 -3.81,3.81
TO220V = drill 1.016 long: 1 -2.54,-2.54; 2 0,-2.54; 3 2.54,-2.54
TO220H = drill 1.118 long: 1 -2.54,-10.16; 2 0,-10.16; 3 2.54,-10.16 | hole 3.302: 0,4.826
BU-SMB-V = drill 1.4: 1 0,0; 2 -2.54,2.54; 3 2.54,2.54; 4 2.54,-2.54; 5 -2.54,-2.54
1X08 = drill 1.016 pad 1.88: 1 0,0; 2 2.54,0; 3 5.08,0; 4 7.62,0; 5 10.16,0; 6 12.7,0; 7 15.24,0; 8 17.78,0
ASP13460401 = smd 0.64 x 0.64: C1 24.765,3.175; C2 23.495,3.175; C3 22.225,3.175; C4 20.955,3.175; C5 19.685,3.175; C6 18.415,3.175; C7 17.145,3.175; C8 15.875,3.175; C9 14.605,3.175; C10 13.335,3.175; C11 12.065,3.175; C12 10.795,3.175; C13 9.525,3.175; C14 8.255,3.175; C15 6.985,3.175; C16 5.715,3.175; C17 4.445,3.175; C18 3.175,3.175; C19 1.905,3.175; C20 0.635,3.175; C21 -0.635,3.175; C22 -1.905,3.175; C23 -3.175,3.175; C24 -4.445,3.175; C25 -5.715,3.175; C26 -6.985,3.175; C27 -8.255,3.175; C28 -9.525,3.175; C29 -10.795,3.175; C30 -12.065,3.175; C31 -13.335,3.175; C32 -14.605,3.175; C33 -15.875,3.175; C34 -17.145,3.175; C35 -18.415,3.175; C36 -19.685,3.175; C37 -20.955,3.175; C38 -22.225,3.175; C39 -23.495,3.175; C40 -24.765,3.175; D1 24.765,1.905; D2 23.495,1.905; D3 22.225,1.905; D4 20.955,1.905; D5 19.685,1.905; D6 18.415,1.905; D7 17.145,1.905; D8 15.875,1.905; D9 14.605,1.905; D10 13.335,1.905; D11 12.065,1.905; D12 10.795,1.905; D13 9.525,1.905; D14 8.255,1.905; D15 6.985,1.905; D16 5.715,1.905; D17 4.445,1.905; D18 3.175,1.905; D19 1.905,1.905; D20 0.635,1.905; D21 -0.635,1.905; D22 -1.905,1.905; D23 -3.175,1.905; D24 -4.445,1.905; D25 -5.715,1.905; D26 -6.985,1.905; D27 -8.255,1.905; D28 -9.525,1.905; D29 -10.795,1.905; D30 -12.065,1.905; D31 -13.335,1.905; D32 -14.605,1.905; D33 -15.875,1.905; D34 -17.145,1.905; D35 -18.415,1.905; D36 -19.685,1.905; D37 -20.955,1.905; D38 -22.225,1.905; D39 -23.495,1.905; D40 -24.765,1.905; G1 24.765,-1.905; G2 23.495,-1.905; G3 22.225,-1.905; G4 20.955,-1.905; G5 19.685,-1.905; G6 18.415,-1.905; G7 17.145,-1.905; G8 15.875,-1.905; G9 14.605,-1.905; G10 13.335,-1.905; G11 12.065,-1.905; G12 10.795,-1.905; G13 9.525,-1.905; G14 8.255,-1.905; G15 6.985,-1.905; G16 5.715,-1.905; G17 4.445,-1.905; G18 3.175,-1.905; G19 1.905,-1.905; G20 0.635,-1.905; G21 -0.635,-1.905; G22 -1.905,-1.905; G23 -3.175,-1.905; G24 -4.445,-1.905; G25 -5.715,-1.905; G26 -6.985,-1.905; G27 -8.255,-1.905; G28 -9.525,-1.905; G29 -10.795,-1.905; G30 -12.065,-1.905; G31 -13.335,-1.905; G32 -14.605,-1.905; G33 -15.875,-1.905; G34 -17.145,-1.905; G35 -18.415,-1.905; G36 -19.685,-1.905; G37 -20.955,-1.905; G38 -22.225,-1.905; G39 -23.495,-1.905; G40 -24.765,-1.905; H1 24.765,-3.175; H2 23.495,-3.175; H3 22.225,-3.175; H4 20.955,-3.175; H5 19.685,-3.175; H6 18.415,-3.175; H7 17.145,-3.175; H8 15.875,-3.175; H9 14.605,-3.175; H10 13.335,-3.175; H11 12.065,-3.175; H12 10.795,-3.175; H13 9.525,-3.175; H14 8.255,-3.175; H15 6.985,-3.175; H16 5.715,-3.175; H17 4.445,-3.175; H18 3.175,-3.175; H19 1.905,-3.175; H20 0.635,-3.175; H21 -0.635,-3.175; H22 -1.905,-3.175; H23 -3.175,-3.175; H24 -4.445,-3.175; H25 -5.715,-3.175; H26 -6.985,-3.175; H27 -8.255,-3.175; H28 -9.525,-3.175; H29 -10.795,-3.175; H30 -12.065,-3.175; H31 -13.335,-3.175; H32 -14.605,-3.175; H33 -15.875,-3.175; H34 -17.145,-3.175; H35 -18.415,-3.175; H36 -19.685,-3.175; H37 -20.955,-3.175; H38 -22.225,-3.175; H39 -23.495,-3.175; H40 -24.765,-3.175 | hole 1.27: 27.189,0; -27.191,-3.05
H4-2.54 = drill 0.889 pad 1.651 square: 1 0,3.81 | drill 0.889 pad 1.651: 2 0,1.27; 3 0,-1.27; 4 0,-3.81
6000-XXXX-RC = drill 0.9 pad 1.422: 1 -2.5,0; 2 2.5,0
R0805 = smd 1.3 x 1.5: 1 -0.95,0; 2 0.95,0
AXIAL-0.3 = drill 0.9 pad 1.88: P$1 -3.81,0; P$2 3.81,0
RTRIM3296W = drill 0.61: 1 0,-2.54; 2 0,0; 3 0,2.54
FE20 = drill 0.813 long: 1 -24.13,0; 2 -21.59,0; 3 -19.05,0; 4 -16.51,0; 5 -13.97,0; 6 -11.43,0; 7 -8.89,0; 8 -6.35,0; 9 -3.81,0; 10 -1.27,0; 11 1.27,0; 12 3.81,0; 13 6.35,0; 14 8.89,0; 15 11.43,0; 16 13.97,0; 17 16.51,0; 18 19.05,0; 19 21.59,0; 20 24.13,0
TSSOP20-0.65-6.5X4.4MM = smd 0.35 x 1.5: 1 -2.925,-3.065; 2 -2.275,-3.065; 3 -1.625,-3.065; 4 -0.975,-3.065; 5 -0.325,-3.065; 6 0.325,-3.065; 7 0.975,-3.065; 8 1.625,-3.065; 9 2.275,-3.065; 10 2.925,-3.065; 11 2.91,3.065; 12 2.26,3.065; 13 1.61,3.065; 14 0.96,3.065; 15 0.325,3.065; 16 -0.325,3.065; 17 -0.975,3.065; 18 -1.625,3.065; 19 -2.275,3.065; 20 -2.925,3.065

### Placement (x,y rotation side)
ARDUINO_NANO1  137,26 90 top
C1  66,66 180 top
C2  89,66 0 top
C3  59,67 0 top
C4  69,24 0 top
C5  54,64 0 top
C6  96,7 180 top
C7  69,32 0 top
C8  69,35 0 top
C9  96,4 180 top
C10  59,64 0 top
C11  69,26 0 top
C12  54,70 0 top
C13  54,67 0 top
C14  96,2 180 top
C15  96,9 180 top
C16  90,51 180 top
C17  86,45 0 top
C18  90,45 180 top
C19  86,39 0 top
C20  90,39 180 top
C21  86,33 0 top
C22  90,33 180 top
C23  86,27 0 top
C24  90,27 180 top
C25  86,21 0 top
C26  69,48 0 top
C27  61,43 0 top
C28  69,39 0 top
C29  61,34 0 top
C30  69,30 0 top
C31  61,25 0 top
C32  94,50 180 top
C33  82,50 180 top
C34  82,30 0 top
C35  82,23 0 top
C36  94,30 0 top
C37  94,23 0 top
C38  124,65 270 top
C39  138,65 270 top
C40  121,65 270 top
C41  107,65 270 top
C42  133,63 180 top
C43  106,72 180 top
C44  115,63 0 top
C45  106,70 0 top
C46  96,66 180 top
C47  73,66 0 top
IC1  63,29 0 top
IC3  88,30 0 top
IC4  88,48 0 top
IC5  84,7 270 top
IC6  63,38 0 top
IC7  63,47 0 top
IC8  88,24 0 top
IC9  88,42 0 top
IC10  88,36 0 top
IC11  69,73 0 top
IC12  92,81 0 top
IO_G2  72,16 270 top
IO_G3  72,6 270 top
IO_H4  59,16 270 top
IO_H5  59,6 270 top
J1  145,54 90 top
J2  10,37 270 bottom
J3  32,60 0 top
J4  20,60 0 top
J5  71,53 180 top
J6  26,60 0 top
J7  23,60 0 top
J8  35,60 0 top
J12  29,60 0 top
L1  131,69 180 top
L2  114,69 180 top
OPIN  83,57 90 top
PULSESUMOUT  95,57 0 top
R1  94,48 180 top
R2  82,52 180 top
R3  56,27 180 top
R4  67,16 90 top
R5  67,6 90 top
R6  56,49 180 top
R7  94,39 180 top
R8  100,45 0 top
R9  56,33 180 top
R10  56,30 0 top
R11  82,48 0 top
R12  100,42 0 top
R13  82,45 0 top
R14  76,45 180 top
R15  54,16 90 top
R16  54,6 90 top
R17  56,24 180 top
R18  56,41 180 top
R19  56,38 0 top
R20  82,42 0 top
R21  82,32 180 top
R22  82,28 180 top
R23  94,32 180 top
R24  94,28 180 top
R25  76,42 180 top
R26  56,46 0 top
R27  82,25 180 top
R28  82,21 180 top
R29  94,25 180 top
R30  94,21 180 top
R31  43,69 270 top
R32  100,39 0 top
R33  94,42 180 top
R34  94,52 0 top
R35  43,64 270 top
R36  94,36 180 top
R37  43,59 270 top
R38  100,36 0 top
R39  43,54 270 top
R40  94,45 180 top
R41  43,48 270 top
R42  76,52 180 top
R43  43,43 270 top
R45  43,38 270 top
R47  43,33 270 top
R_O1  43,19 90 top
R_O2  43,14 90 top
R_VH  43,4 90 top
R_VL  43,9 90 top
SV1  23,27 90 top
SV2  28,27 90 top
U1  105,7 270 top

### Tracks (layer width: path | path; a pad name or v marks a point on that pad's centre or on a via)
1V8  (9 unrouted)
3V3  (8 unrouted)
12V  (6 unrouted)
AR_5V  (1 unrouted)
AR_G36  (1 unrouted)
AR_G37  (1 unrouted)
AR_SCLIN  (1 unrouted)
AR_SDAIN  (1 unrouted)
C10  (2 unrouted)
C11  (2 unrouted)
C14  (2 unrouted)
C15  (2 unrouted)
G2  (2 unrouted)
G3  (2 unrouted)
G36  (1 unrouted)
G37  (1 unrouted)
GND  (46 unrouted)
  pour gnd: 148,75 148,-2 -2,-2 -2,75
  pour topgnd: 149,77 149,-3 -4,-3 -4,77
  cutout topgnd: 81,52 96,52 96,19 81,19
  cutout topgnd: 58,51 68,51 68,24 58,24
H4  (2 unrouted)
H5  (2 unrouted)
H13  (1 unrouted)
H14  (1 unrouted)
H16  (1 unrouted)
H17  (1 unrouted)
H19  (1 unrouted)
H20  (1 unrouted)
H22  (1 unrouted)
H23  (1 unrouted)
H25  (1 unrouted)
H26  (1 unrouted)
H27  (1 unrouted)
H28  (1 unrouted)
H31  (1 unrouted)
H32  (1 unrouted)
H34  (2 unrouted)
H35  (2 unrouted)
H37  (2 unrouted)
H38  (2 unrouted)
IO1  (1 unrouted)
  top 0.305: OPIN.1 79,57 76.95,54.95 76.95,54 | 76.95,54 R42.1 | J5.1 72,54 76.95,54
N$1  (1 unrouted)
  top 0.305: R14.1 R13.1
N$2  (1 unrouted)
N$3
  top 0.305: R9.1 R10.2 57.31,29.64 IC1.2
N$4
  top 0.305: R23.1 94.95,31.85 C36.1 | R24.2 93.05,29.95 C36.1 | C36.1 92.78,29.68 IC3.6
N$8  (1 unrouted)
N$9
  top 0.305: R18.1 R19.2 58.65,38 59.29,38.63 IC6.2
N$10  (1 unrouted)
  top 0.305: R20.1 R25.1
N$11
  top 0.305: R6.1 56.95,47 | 56.95,47 R26.2 | 56.95,47 57.59,47.63 IC7.2
N$12
  top 0.305: R27.2 82.95,23.1 82.95,22.95 | IC8.2 84.22,24.32 C35.2 82.95,22.95 | 82.95,22.95 R28.1
N$13
  top 0.305: R22.1 82.95,29.95 C34.2 83,30 | 83,30 84.74,30 85.07,30.32 IC3.2 | R21.2 83,30.05 83,30
N$14
  top 0.305: C37.1 94.95,24.85 R29.1 | R30.2 93.05,22.95 C37.1 | C37.1 92.42,23.68 IC8.6
N$18
  top 0.305: R34.2 94.95,56.95 PULSESUMOUT.1
OFFSETIN1  (3 unrouted)
OFFSETIN2  (3 unrouted)
OFFSETOUT1  (2 unrouted)
OFFSETOUT2  (2 unrouted)
OP2BUF  (1 unrouted)
  top 0.305: 56.52,43.48 55.05,42 R18.2 53,41 52,42 52,51.78 J5.8 | 56.52,43.48 56.86,43.81 | IC7.3 59.41,46.37 57.02,43.98 | IC6.6 65.64,37.37 65,38.01 64.82,38.01 62,40.83 62,41 59,41 56.52,43.48
OPOUT1_H10  (3 unrouted)
  top 0.305: R9.2 55.12,33 56.17,34.05 57.95,34.05 60.47,31.54 61.18,31.54 64.35,28.36 IC1.6
OPOUT2_H11  (2 unrouted)
  top 0.305: R6.2 55.12,49 56.17,50.05 | 56.17,50.05 60.95,50.05 65,46 65.35,46 IC7.6 | J5.6 58.3,52.18 56.17,50.05
PULSEINN1  (1 unrouted)
  top 0.305: R22.2 81.1,28.05 C34.1
  route 0.305: R41.2 60,31 79,31
PULSEINN2  (1 unrouted)
  top 0.305: C36.2 94.9,28.05 R24.1
  route 0.305: R43.2 58,28 97,28
PULSEINN3  (1 unrouted)
  top 0.305: C35.1 81.1,21.05 R28.2
  route 0.305: R45.2 56,25 79,25
PULSEINN4  (1 unrouted)
  top 0.305: C37.2 94.95,22.95 R30.1
  route 0.305: R47.2 54,22 97,22
PULSEINP1  (via drill 0.35)
  top 0.305: IC9.3 85.67,41.8 84.95,41.8 84.74,42 v84.08,42
  route 0.305: R31.2 44,68 44,63.65 44.46,63.19 44.46,58.19 60.65,42 v84.08,42
PULSEINP2  (via drill 0.35)
  top 0.305: v91.99,40.99 90.25,40.99 IC9.5
  route 0.305: R35.2 44,63 44,58 61,41 v92,41 v91.99,40.99
PULSEINP3  (1 unrouted)
  route 0.305: R37.2 43,58 65,36 83,36
PULSEINP4  (1 unrouted)
  route 0.305: 92,34 63,34 R39.2
PULSEOUTN1  (1 unrouted)
  top 0.305: IC3.1 85.03,30.98 84,32 R21.1
PULSEOUTN2  (1 unrouted)
  top 0.305: R23.2 91.38,30.32 IC3.7
PULSEOUTN3  (1 unrouted)
  top 0.305: R27.1 85.76,25 IC8.1
PULSEOUTN4  (1 unrouted)
  top 0.305: R29.2 92.38,24.32 IC8.7
PULSEOUTP1  (1 unrouted)
  top 0.305: IC9.1 IC9.2
PULSEOUTP2  (1 unrouted)
  top 0.305: R33.2 90.54,42 IC9.6
PULSEOUTP3  (1 unrouted)
  top 0.305: IC10.1 IC10.2
PULSEOUTP4  (1 unrouted)
  top 0.305: IC10.7 90.54,36 R36.2
PULSESUMIN
  top 0.305: IC4.6 91.54,47.67 92.27,46.95 93.89,46.95 R1.1 | R1.1 R40.1 95,45 | 95,45 R8.1 R12.1 R32.1 R38.1 | R36.1 R7.1 R33.1 94.95,44.95 | 94.95,44.95 95,45 | C32.1 94.95,49.95 R1.1 | R1.1 94.95,44.95
PULSESUMOUT  (1 unrouted)
  top 0.305: IC4.7 92.72,48.33 R1.2 93.1,48.05 C32.2 93.05,50.05 R34.1
SCLIN  (2 unrouted)
SDAIN  (2 unrouted)
TRANSIN
  top 0.305: R2.1 82.95,50.05 | 82.95,50.05 C33.1 82.9,48.05 R11.2 | IC4.2 85.91,48.45 86.63,48.45 86.81,48.62 86.81,49.33 86.08,50.05 82.95,50.05
TRANSOUT  (1 unrouted)
  top 0.305: IC4.1 85.67,48.85 84.95,48.85 83.91,47.81 83.91,47.12 83.73,46.95 83,46.95 | 83,46.95 82.17,46.95 81.12,48 R11.1 | 83,46.95 83,45.05 R13.2 R20.2 | J5.5 61,52.84 61,51 62,50 C33.2
VH  (4 unrouted)
  top 0.305: C7.1 66.81,32 IC1.8
VIN+
  top 0.508: C42.1 133.9,68.6 L1.1 135,67.5 C39.1 141.34,64.16 J1.5
VIN+CLEAN
  top 0.508: L1.2 127,67.5 C38.1 122.74,67.5 121.51,68.73 121.27,68.73 118,72 C43.1 106.67,72 105.67,73.01 104.53,73.01 104.45,72.92 68.92,72.92 IC11.1
VIN-
  top 0.508: J1.7 136.76,69.24 135,71 133,71 128,66 122,66 121,67 C40.1 118,67.5 L2.1 116.5,63.6 C44.2
VIN-CLEAN
  top 0.508: L2.2 107.9,69 C45.2 | C45.2 107,69.9 C41.1 | C45.2 101.89,64.99 94.53,64.99 94.53,65 94,65 92.73,66.27 92.73,66.51 92,67.24 IC12.2
VL  (4 unrouted)
  top 0.305: C8.1 66.81,35 IC6.5
VS+  (20 unrouted)
  top 0.508: C16.1 90.9,49.66 IC4.8 | C18.1 90.9,43.66 IC9.8 | C20.1 90.9,37.66 IC10.8 | C22.1 90.9,31.66 IC3.8 | C24.1 90.9,25.66 IC8.8 | IC6.7 67.73,38.63 C28.1 | IC7.7 66.08,48 C26.1 | IC1.7 66.08,30 C30.1 | IC11.3 72.1,69.9 C47.1 C1.1 67.5,67 64.24,67 63.24,68.01 59.33,68.01 59.33,68 59,68 58.1,67.1 C3.1
VS-  (10 unrouted)
  top 0.508: C25.1 85.1,22.34 IC8.4 87.03,23.02 IC8.9 IC3.9 | C21.1 85.1,34 | 85.1,34 85.1,34.34 IC10.4 87.03,35.02 IC10.9 | C17.1 85.1,46.34 IC4.4 87.03,47.02 IC4.9 | IC9.9 87.03,41.02 IC9.4 85.1,40.34 C19.1 74,39 68.64,44.36 64.78,44.36 64.05,45.09 IC7.4 60.1,44.91 C27.1 | IC3.9 87.03,29.02 IC3.4 85.1,28.34 C23.1 84.94,26.84 70.63,26.84 70.47,27.01 67.53,27.01 65.53,25 65,25 62.91,27.09 IC1.4 60.1,26.91 C31.1 | C29.1 60.1,35.91 IC6.4 64.05,36.09 66.65,33.49 84.59,33.49 85.1,34 | IC12.3 94.54,66.56 C46.2 | C2.2 91.5,65 | 91.5,65 91.5,64.5 88,61 IC4.9 | IC4.9 IC9.9 | IC9.9 IC10.9 | IC10.9 IC3.9 | C10.1 58.33,64 59.33,65.01 60.47,65.01 60.71,64.77 91.27,64.77 91.5,65

### Text on the board
tPlace: GND | P1 | VIN- | 8.5mm diam. | GND | VS- | VS+ | 1.8V | 3.3V | 12V | GND | VIN+ | P2 | Vlow | Vhigh | P3 | +VS 5 | OP2BUF | OFFSETIN2 | OPOUT2 H11 | TRANSOUT | OFFSETIN1 | OPOUT1 H10 | PULSESUMOUT | OPIN | AR 5V | H26_FMCOUT3 | P4 | H25_FMCOUT2 | GND | GND | GND | GND | N1 | H23_FMCOUT1 | H22_FMCOUT0 | C15_pulse4p | N2 | C14_pulse3p | GND | GND | H20_FMCIN7 | C11_pulse2p | N3 | H19_FMCIN6 | C10_pulse1p | GND | GND | N4 | H17_FMCIN5 | H38_pulse4n | H16_FMCIN4 | H37_pulse3n | GND | GND | H14_FMCIN3 | H35_pulse2n | H13_FMCIN2 | H34_pulse1n | Offset1 | GND | GND | H11_FMCIN1 | H32_FMCOUT7 | H10_FMCIN0 | Offset2 | H31_FMCOUT6 | GND | GND | VL | H8_SDAIN | H29_FMCOUT5 | H7_SCLIN | C10GX FMC breakout, v1.21 / by Andre Dubovskiy and Dr. Andy Haas / NYU, 2023 | H28_FMCOUT4 | VH